# Altium schematic sheet 云台电源板.SchDoc
size A4; SheetNumber: 1; SheetTotal: 1
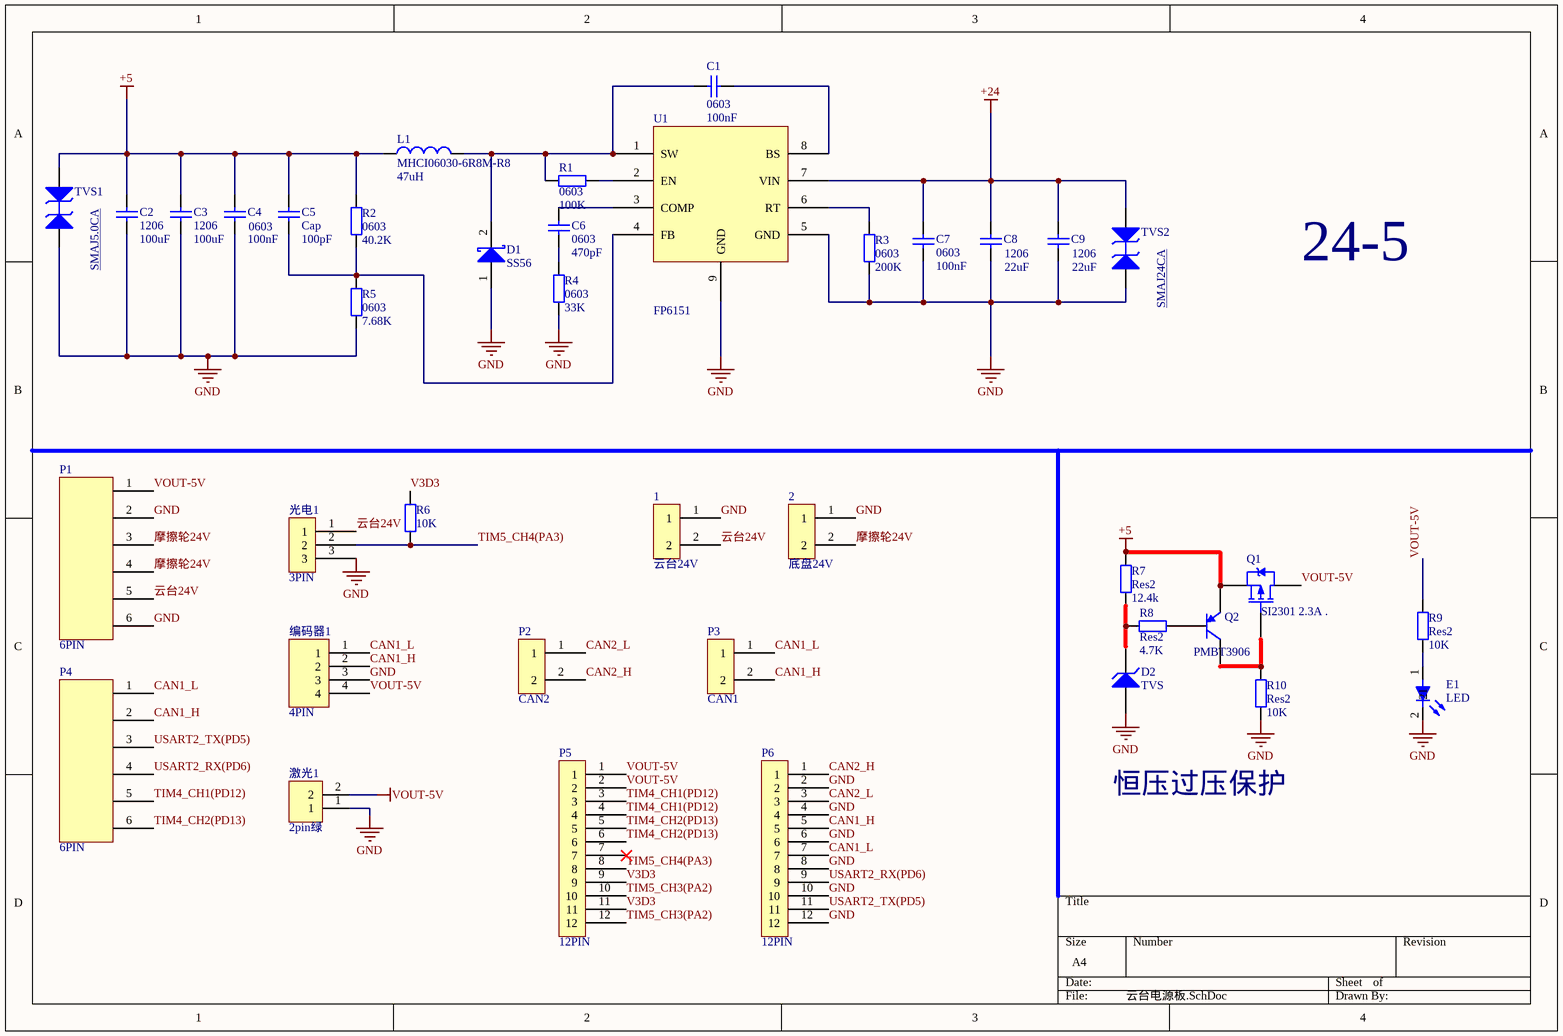
[diagram p0: 云台电源板.SchDoc]

## Parts
1  云台24V  [XT30 pw]
2  底盘24V  [XT30 pw]
C1  0603  0603: 100nF  [C0603]
C2  1206  value 100uF  [C1206]
C3  1206  value 100uF  [C1206]
C4  0603  value 100nF  [C0603]
C5  Cap  value 100pF  [C0603]
C6  0603  value 470pF  [C0603]
C7  0603  0603: 100nF  [C0603]
C8  1206  value 22uF  [C1206]
C9  1206  value 22uF  [C1206]
D1  D-Schottky  [SS56]  (value not drawn)
D2  TVS  [SMA]
E1  LED  [LED0805]
L1  MHCI06030-6R8M-R8  value 47uH  [L]
P1  6PIN  [43045-6P-L]
P2  CAN2  [XH2.54-2-W]
P3  CAN1  [XH2.54-2-W]
P4  6PIN  [43045-6P-L]
P5  12PIN  [2mm-2-12]
P6  12PIN  [2mm-2-12]
Q1  SI2301 2.3A .  [SOT23]
Q2  PMBT3906  [SOT23]
R1  0603  0603: 100K  [R0603]
R2  0603  value 40.2K  [R0603]
R3  0603  0603: 200K  [R0603]
R4  0603  value 33K  [R0603]
R5  0603  value 7.68K  [R0603]
R6  value 10K  [R0805]  (hidden comment: Res1)
R7  Res2  value 12.4k  [0603(偏大)]
R8  Res2  value 4.7K  [0603(偏大)]
R9  Res2  value 10K  [0603(偏大)]
R10  Res2  value 10K  [0603(偏大)]
TVS1  SMAJ5.0CA  [SMAJ]
TVS2  SMAJ24CA  [SMAJ]
U1  FP6151  [FP6151]
光电1  3PIN  [GH1.25 3PIN]
激光1  2pin绿  [532610271]
编码器1  4PIN  [XH2.54-4-w]

## Nets
+5: C2.2 C3.2 C4.2 C5.2 L1.1 Q1.2(s) Q2.2 R2.2 R7.2 TVS1.2(K)
+24: C7.2 C8.2 C9.2 TVS2.2(K) U1.7(VIN)
GND: 1.1 2.1 C2.1 C3.1 C4.1 C7.1 C8.1 C9.1 D1.1(A) D2.1(A) E1.2 P1.2 P1.6 P6.2 P6.4 P6.6 P6.8 P6.10 P6.12 R3.1 R4.1 R5.1 R10.1 TVS1.1(A) TVS2.1(A) U1.5(GND) U1.9(GND) 光电1.3 激光1.1 编码器1.3
VOUT-5V: P1.1 P5.1 P5.2 Q1.3(D) R9.1 激光1.2 编码器1.4
CAN1_H: P3.2 P4.2 P6.5 编码器1.2
CAN1_L: P3.1 P4.1 P6.7 编码器1.1
CAN2_H: P2.2 P6.1
CAN2_L: P2.1 P6.3
TIM4_CH1(PD12): P4.5 P5.3 P5.4
TIM4_CH2(PD13): P4.6 P5.5 P5.6
TIM5_CH3(PA2): P5.10 P5.12
TIM5_CH4(PA3): P5.8 R6.1 光电1.2
USART2_RX(PD6): P4.4 P6.9
USART2_TX(PD5): P4.3 P6.11
V3D3: P5.9 P5.11 R6.2
云台24V: 1.2 P1.5 光电1.1
摩擦轮24V: 2.2 P1.3 P1.4
NetC1_1: C1.1 U1.8(BS)
NetC1_2: C1.2 D1.2(K) L1.2 R1.2 U1.1(SW)
NetC5_1: C5.1 R2.1 R5.2 U1.4(FB)
NetC6_1: C6.1 R4.2
NetC6_2: C6.2 U1.3(COMP)
NetD2_2: D2.2(K) R7.1 R8.1
NetE1_1: E1.1 R9.2
NetQ1_1: Q1.1(G) Q2.3 R10.2
NetQ2_1: Q2.1 R8.2
NetR1_1: R1.1 U1.2(EN)
NetR3_2: R3.2 U1.6(RT)

Not connected (* = marked no-connect by the designer): P5 7*

## Notes on the sheet
- 24-5
- 恒压过压保护

## Library data of the parts
1 2 P2 P3 = 2PIN
C1-C9 = Cap: Capacitor; Published: 8-Jun-2000; LatestRevisionDate: 17-Jul-2002; LatestRevisionNote: Re-released for DXP Platform.; PackageReference: RAD-0.3; Publisher: Altium Limited; PackageDescription: Radial Cap, Thru-Hole; 2 Leads; 0.3 in Pin Spacing
D1 = D-Schottky: 肖特基二极管; Published: 8-Jun-2000; LatestRevisionDate: 17-Jul-2002; LatestRevisionNote: Re-released for DXP Platform.; PackageReference: SMB; Publisher: Altium Limited; Code_JEDEC: DO-214-AA; Type: SS56
D2 = D Zener: Zener Diode; Published: 8-Jun-2000; LatestRevisionDate: 17-Jul-2002; LatestRevisionNote: Re-released for DXP Platform.; PackageReference: DIODE-0.7; Publisher: Altium Limited; PackageDescription: Diode, Thru-Hole; 2 Leads; 0.7 in Pin Spacing
E1 = LED: Typical RED, GREEN, YELLOW, AMBER GaAs LED; Published: 8-Jun-2000; LatestRevisionDate: 17-Jul-2002; LatestRevisionNote: Re-released for DXP Platform.; PackageDocument: Feb-2002; PackageReference: 3.2X1.6X1.1; Publisher: Altium Limited
L1 = Inductor: Code_IEC: 1005; Published: 8-Jun-2000; LatestRevisionDate: 29-May-2009; LatestRevisionNote: IPC-7351 Footprint Added.; PackageReference: 0402-A; Publisher: Altium Limited; PackageDescription: Chip Inductor; Code_JEITA: 0402
Q1 = PMOS-2: P-Channel Power MOSFET; Note: Pin 4 not drawn and electrically connected to Pin 2.; Published: 8-Jun-2000; LatestRevisionDate: 17-Jul-2002; LatestRevisionNote: Re-released for DXP Platform.; DatasheetVersion: PD-9.390D; PackageVersion: Feb-1997; PackageReference: TO-220AB; Publisher: Altium Limited; PackageDescription: TO, Thru-Hole, Vertical, Heatsink Mounted; 3 In-Line Leads; Pitch 2.54 mm; ComponentLink1Description: Manufacturer Link; ComponentLink1URL: http://www.irf.com/
Q2 = PNP: PNP Bipolar Transistor; Published: 8-Jun-2000; LatestRevisionDate: 29-May-2009; LatestRevisionNote: IPC-7351 Footprint Added.; PackageVersion: Aug-1999; PackageReference: SOT-23B; Publisher: Altium Limited; PackageDescription: 3-Pin SOT-23 Package 0.95 mm Pitch, 2.4 mm Lead Span
R1-R5 R7-R10 = Res2: Resistor; Published: 8-Jun-2000; LatestRevisionDate: 17-Jul-2002; LatestRevisionNote: Re-released for DXP Platform.; PackageReference: AXIAL-0.4; Publisher: Altium Limited; PackageDescription: Axial Device, Thru-Hole; 2 Leads; 0.4 in Pin Spacing
R6 = Res1: 贴片电阻; Published: 8-Jun-2000; LatestRevisionDate: 17-Jul-2002; LatestRevisionNote: Re-released for DXP Platform.; PackageReference: AXIAL-0.4; Publisher: Altium Limited
TVS1 TVS2 = TVS
激光1 = Molex-53398-0271: Molex-53261-0871; LatestRevisionDate: 17-Jul-2002; LatestRevisionNote: Re-released for DXP Platform.; Publisher: Altium Limited